# Altium schematic sheet Ethernet.SchDoc
size A3; SheetNumber: 1; SheetTotal: 1; PageSetup: Record=PageOptions|CenterHorizontal=True|CenterVertical=True|PrintScale=0.97|XCorrection=1.00|YCorrection=1.00|PrintKind=1|BorderSize=5000000|LeftOffset=0|BottomOffset=0|Orientation=2|PaperLength=2970|PaperWidth=2100|Scale=100|PaperSource=7|PrintQuality=600|MediaType=1|DitherType=10|PaperKind=A4|PrintScaleMode=1
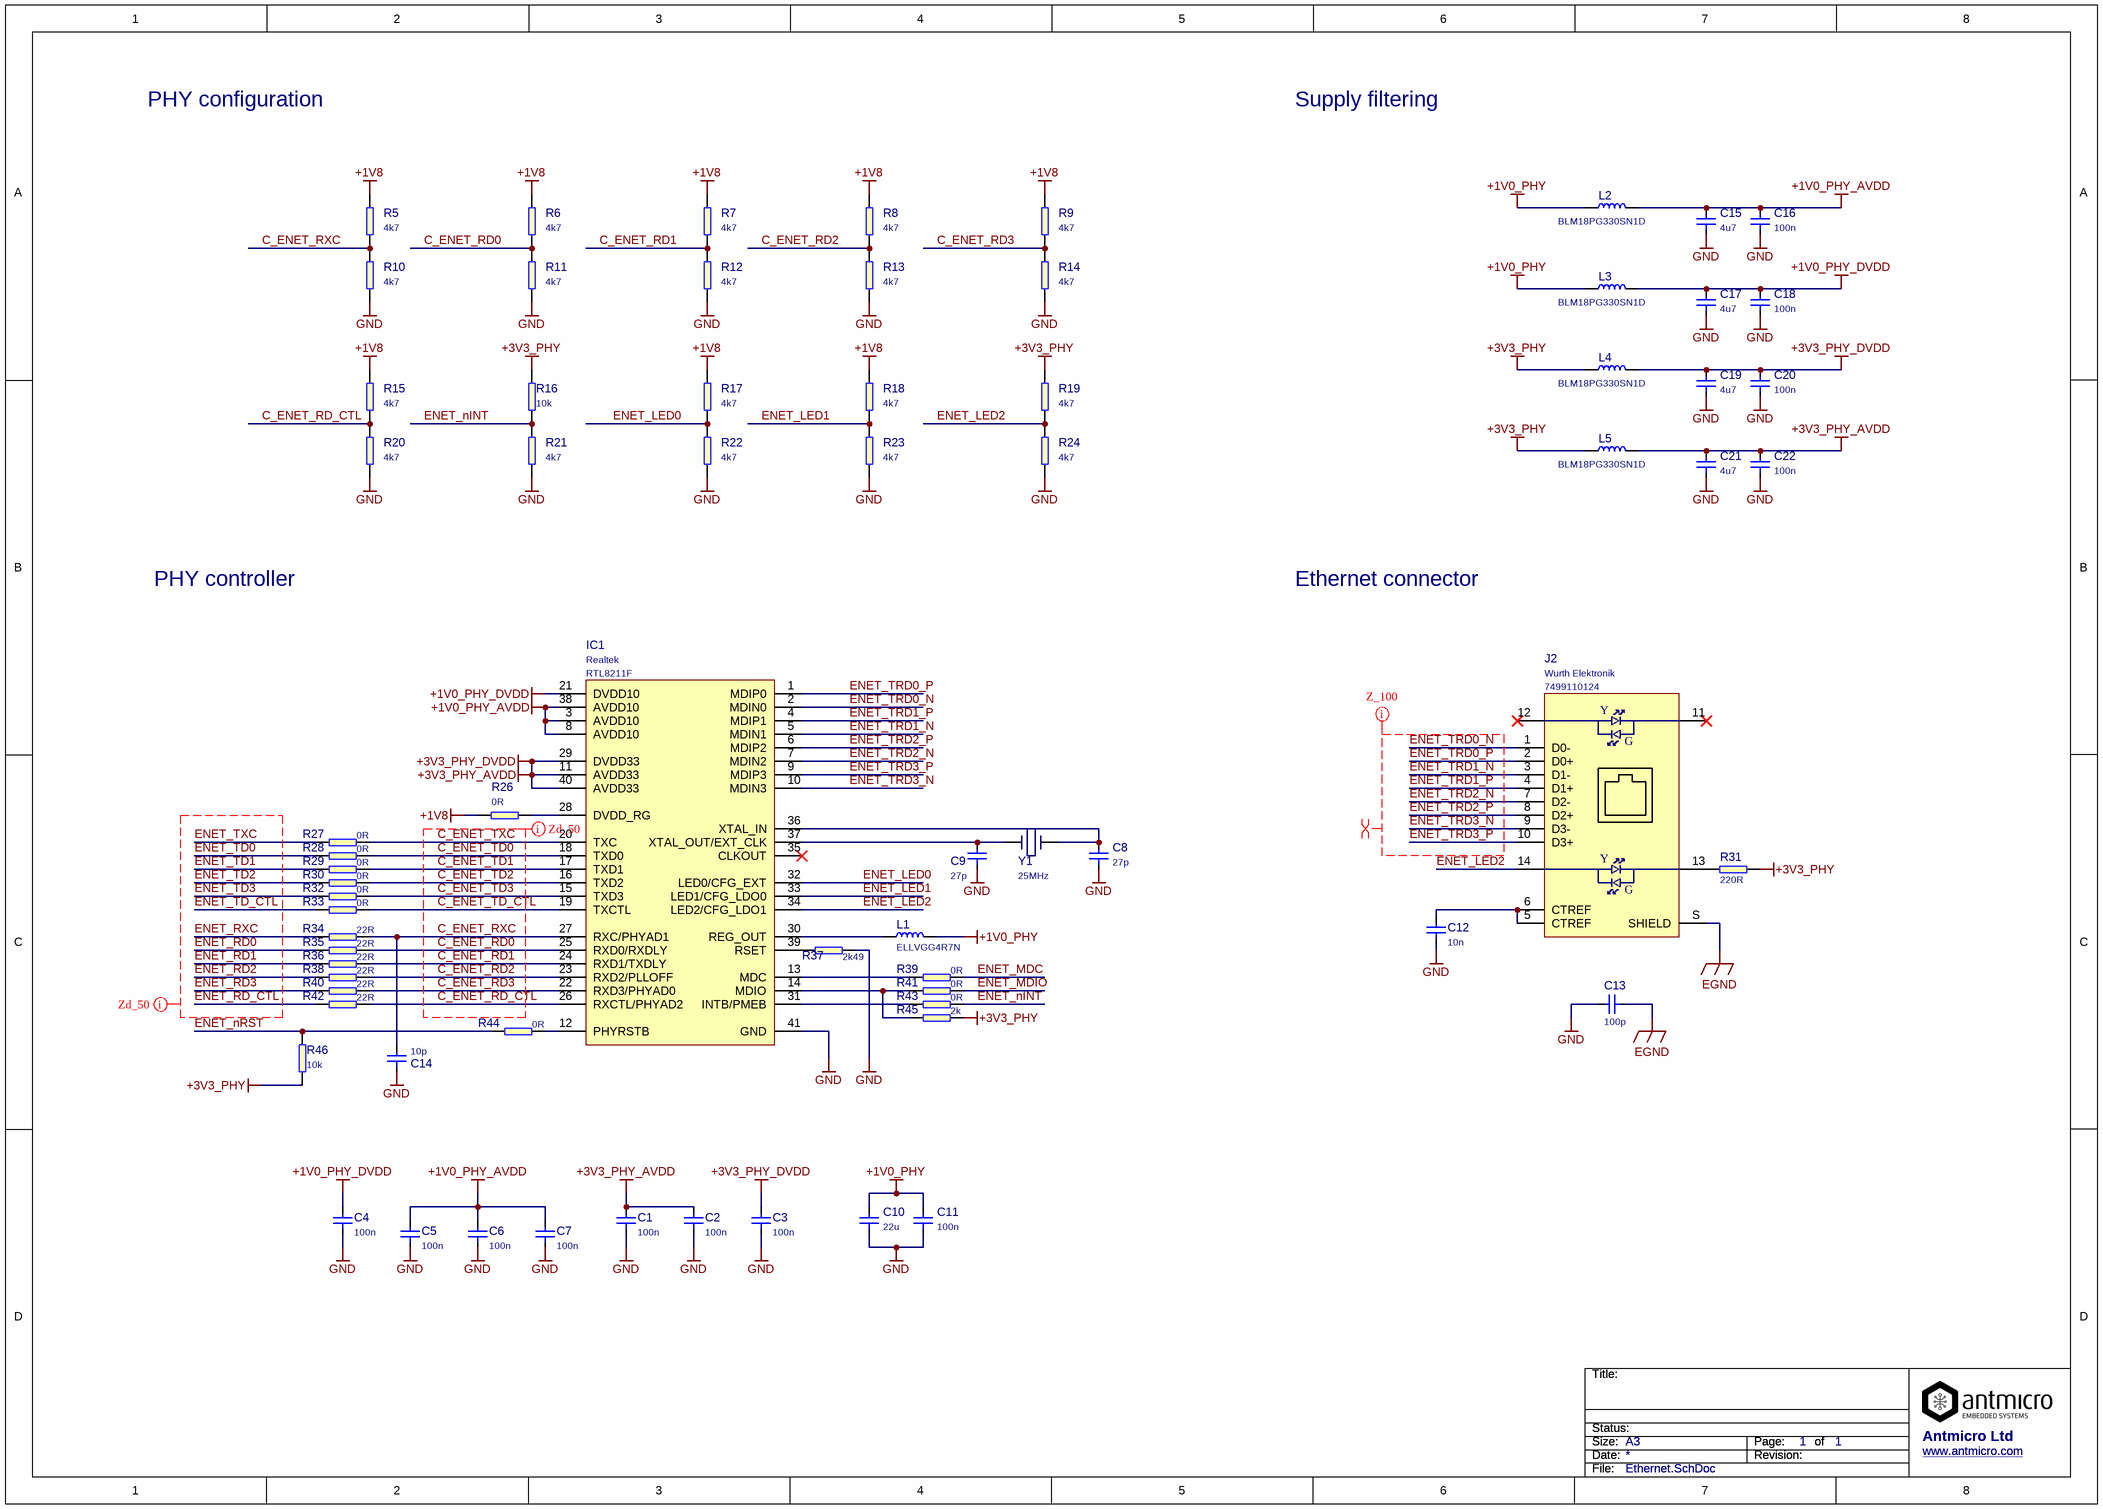
[diagram p0: Ethernet.SchDoc]

## Parts
C1  100n  [C_0402]
C2  100n  [C_0402]
C3  100n  [C_0402]
C4  100n  [C_0402]
C5  100n  [C_0402]
C6  100n  [C_0402]
C7  100n  [C_0402]
C8  27p  [C_0402]
C9  27p  [C_0402]
C10  22u  [1210]
C11  100n  [C_0402]
C12  10n  [0603]
C13  100p  [0603]
C14  10p  [C_0402]
C15  4u7  [0603]
C16  100n  [C_0402]
C17  4u7  [0603]
C18  100n  [C_0402]
C19  4u7  [0603]
C20  100n  [C_0402]
C21  4u7  [0603]
C22  100n  [C_0402]
IC1  RTL8211F  Manufacturer: Realtek  [RTL8211F]
J2  Manufacturer: Wurth Elektronik  [WE_7499110124]  (hidden comment: 7499110124)
L1  ELLVGG4R7N  [ELLVGG4R7N]
L2  BLM18PG330SN1D  [0603]
L3  BLM18PG330SN1D  [0603]
L4  BLM18PG330SN1D  [0603]
L5  BLM18PG330SN1D  [0603]
R5  4k7  [0402]
R6  4k7  [0402]
R7  4k7  [0402]
R8  4k7  [0402]
R9  4k7  [0402]
R10  4k7  [0402]
R11  4k7  [0402]
R12  4k7  [0402]
R13  4k7  [0402]
R14  4k7  [0402]
R15  4k7  [0402]
R16  10k  [0402]
R17  4k7  [0402]
R18  4k7  [0402]
R19  4k7  [0402]
R20  4k7  [0402]
R21  4k7  [0402]
R22  4k7  [0402]
R23  4k7  [0402]
R24  4k7  [0402]
R26  0R  [0402]
R27  0R  [0402]
R28  0R  [0402]
R29  0R  [0402]
R30  0R  [0402]
R31  220R  [0402]
R32  0R  [0402]
R33  0R  [0402]
R34  22R  [0402]
R35  22R  [0402]
R36  22R  [0402]
R37  2k49  [0603]
R38  22R  [0402]
R39  0R  [0402]
R40  22R  [0402]
R41  0R  [0402]
R42  22R  [0402]
R43  0R  [0402]
R44  0R  [0402]
R45  2k  [0402]
R46  10k  [0402]
Y1  25MHz  [TXC_7A]

## Nets
+1V0_PHY: C10.2 C11.2 L1.2 L2.1 L3.1
+1V0_PHY_AVDD: C5.2 C6.2 C7.2 C15.2 C16.2 IC1.3(AVDD10) IC1.8(AVDD10) IC1.38(AVDD10) L2.2
+1V0_PHY_DVDD: C4.2 C17.2 C18.2 IC1.21(DVDD10) L3.2
+1V8: R5.2 R6.2 R7.2 R8.2 R9.2 R15.2 R17.2 R18.2 R26.1
+3V3_PHY: L4.1 L5.1 R16.2 R19.2 R31.2 R45.2 R46.1
+3V3_PHY_AVDD: C1.2 C2.2 C3.2 C19.2 C20.2 C21.2 C22.2 IC1.11(AVDD33) IC1.29(DVDD33) IC1.40(AVDD33) L4.2 L5.2  [also labelled +3V3_PHY_DVDD]
EGND: C13.1 J2.S(SHIELD)
GND: C1.1 C2.1 C3.1 C4.1 C5.1 C6.1 C7.1 C8.1 C9.1 C10.1 C11.1 C12.1 C13.2 C14.1 C15.1 C16.1 C17.1 C18.1 C19.1 C20.1 C21.1 C22.1 IC1.41(GND) R10.1 R11.1 R12.1 R13.1 R14.1 R20.1 R21.1 R22.1 R23.1 R24.1 R37.2
C_ENET_RD0: IC1.25(RXD0/RXDLY) R6.1 R11.2 R35.2
C_ENET_RD1: IC1.24(RXD1/TXDLY) R7.1 R12.2 R36.2
C_ENET_RD2: IC1.23(RXD2/PLLOFF) R8.1 R13.2 R38.2
C_ENET_RD3: IC1.22(RXD3/PHYAD0) R9.1 R14.2 R40.2
C_ENET_RD_CTL: IC1.26(RXCTL/PHYAD2) R15.1 R20.2 R42.2
C_ENET_RXC: C14.2 IC1.27(RXC/PHYAD1) R5.1 R10.2 R34.2
C_ENET_TD0: IC1.18(TXD0) R28.2
C_ENET_TD1: IC1.17(TXD1) R29.2
C_ENET_TD2: IC1.16(TXD2) R30.2
C_ENET_TD3: IC1.15(TXD3) R32.2
C_ENET_TD_CTL: IC1.19(TXCTL) R33.2
C_ENET_TXC: IC1.20(TXC) R27.2
ENET_LED0: IC1.32(LED0/CFG_EXT) R17.1 R22.2
ENET_LED1: IC1.33(LED1/CFG_LDO0) R18.1 R23.2
ENET_LED2: IC1.34(LED2/CFG_LDO1) J2.14 R19.1 R24.2
ENET_MDC: R39.2
ENET_MDIO: R41.2
ENET_nINT: R16.1 R21.2 R43.2
ENET_nRST: R44.1 R46.2
ENET_RD0: R35.1
ENET_RD1: R36.1
ENET_RD2: R38.1
ENET_RD3: R40.1
ENET_RD_CTL: R42.1
ENET_RXC: R34.1
ENET_TD0: R28.1
ENET_TD1: R29.1
ENET_TD2: R30.1
ENET_TD3: R32.1
ENET_TD_CTL: R33.1
ENET_TRD0_N: IC1.2(MDIN0) J2.1(D0-)
ENET_TRD0_P: IC1.1(MDIP0) J2.2(D0+)
ENET_TRD1_N: IC1.5(MDIN1) J2.3(D1-)
ENET_TRD1_P: IC1.4(MDIP1) J2.4(D1+)
ENET_TRD2_N: IC1.7(MDIN2) J2.7(D2-)
ENET_TRD2_P: IC1.6(MDIP2) J2.8(D2+)
ENET_TRD3_N: IC1.10(MDIN3) J2.9(D3-)
ENET_TRD3_P: IC1.9(MDIP3) J2.10(D3+)
ENET_TXC: R27.1
NetC8_2: C8.2 IC1.36(XTAL_IN) Y1.2
NetC9_2: C9.2 IC1.37(XTAL_OUT/EXT_CLK) Y1.1
NetC12_2: C12.2 J2.5(CTREF) J2.6(CTREF)
NetIC1_12: IC1.12(PHYRSTB) R44.2
NetIC1_13: IC1.13(MDC) R39.1
NetIC1_14: IC1.14(MDIO) R41.1 R45.1
NetIC1_28: IC1.28(DVDD_RG) R26.2
NetIC1_30: IC1.30(REG_OUT) L1.1
NetIC1_31: IC1.31(INTB/PMEB) R43.1
NetIC1_39: IC1.39(RSET) R37.1
NetJ2_13: J2.13 R31.1

Not connected (* = marked no-connect by the designer): IC1 35(CLKOUT)*; J2 11* 12*

## Layout directives
net class Z_100: ENET_TRD0_N, ENET_TRD0_P, ENET_TRD1_N, ENET_TRD1_P, ENET_TRD2_N, ENET_TRD2_P, ENET_TRD3_N, ENET_TRD3_P
differential pair: ENET_TRD0_N, ENET_TRD0_P, ENET_TRD1_N, ENET_TRD1_P, ENET_TRD2_N, ENET_TRD2_P, ENET_TRD3_N, ENET_TRD3_P
net class Z_50: C_ENET_RD0, C_ENET_RD1, C_ENET_RD2, C_ENET_RD3, C_ENET_RD_CTL, C_ENET_RXC, C_ENET_TD0, C_ENET_TD1, C_ENET_TD2, C_ENET_TD3, C_ENET_TD_CTL, C_ENET_TXC, ENET_RD0, ENET_RD1, ENET_RD2, ENET_RD3, ENET_RD_CTL, ENET_RXC, ENET_TD0, ENET_TD1, ENET_TD2, ENET_TD3, ENET_TD_CTL, ENET_TXC

## Notes on the sheet
- PHY configuration
- Supply filtering
- PHY controller
- Ethernet connector
- Title:
- Size:
- Date:
- Status:
- A3
- Revision:
- Page:
- of
- Antmicro Ltd
- www.antmicro.com
- File:
- (in symbol WE_7499110124) Y; G

## Library data of the parts
C1-C7 C11 C16 C18 C20 C22 = C_100n_0402: MLCC SMT Capacitor 100nF 0402; PartNumber: C_100n_0402; Value: 100n
C8 C9 = C_27p_0402: MLCC SMT Capacitor 27pF 0402; PartNumber: C_27p_0402; Value: 27p
C10 = C_22u_1210: MLCC SMT Capacitor 22uF 1210; PartNumber: C_22u_1210; Value: 22u
C12 = C_10n_0603: MLCC SMT Capacitor 10nF 0603; PartNumber: C_10n_0603; Value: 10n
C13 = C_100p_0603: MLCC SMT Capacitor 100pF 0603; PartNumber: C_100p_0603; Value: 100p
C14 = C_10p_0402: MLCC SMT Capacitor 10pF 0402; PartNumber: C_10p_0402; Value: 10p
C15 C17 C19 C21 = C_4u7_0603: MLCC SMT Capacitor 4u7F 0603; PartNumber: C_4u7_0603; Value: 4u7
IC1 = RTL8211F: Highly Integrated 10/100/1000m Ethernet Transceiver; PartNumber: RTL8211F; Value: RTL8211F
J2 = WE_7499110124: LAN-Transformer WE-RJ45LAN 10/100/1000 BaseT; PartNumber: 7499110124; Value: 7499110124
L1 = ELLVGG4R7N: PANASONIC ELECTRONIC COMPONENTS  ELLVGG4R7N  Surface Mount Power Inductor, Choke Coil, ELL-VGG Series, 4.7 ?H, ? 30%, Shielded, 0.17 ohm, 980 mA; Manufacturer: PANASONIC ELECTRONIC COMPONENTS / ELLVGG4R7N / PANASONIC ELECTRONIC COMPONENTS; PartNumber: ELLVGG4R7N; Value: ELLVGG4R7N
L2-L5 = BLM18PG330SN1D: MURATA 	BLM18PG330SN1D  FERRITE BEAD, 0.025OHM, 3A, 0603; Value: BLM18PG330SN1D; Manufacturer: MURATA; PartNumber: BLM18PG330SN1D
R5-R15 R17-R24 = R_4k7_0402: SMT Resistor 4k7 0402; PartNumber: R_4k7_0402; Value: 4k7
R16 R46 = R_10k_0402: SMT Resistor 0402; PartNumber: R_10k_0402; Value: 10k
R26-R30 R32 R33 R39 R41 R43 R44 = R_0R_0402: SMT Resistor 0402; PartNumber: R_0R_0402; Value: 0R
R31 = R_220R_0402: SMT Resistor 220R 0402; PartNumber: R_220R_0402; Value: 220R
R34-R36 R38 R40 R42 = R_22R_0402: SMT Resistor 22R 0402; PartNumber: R_22R_0402; Value: 22R
R37 = R_2k49_0603_1%: SMT Resistor 2k49 0603 1%; PartNumber: R_2k49_0603_1%; Value: 2k49
R45 = R_2k_0402: SMT Resistor 2k 0402; PartNumber: R_2k_0402; Value: 2k
Y1 = CRYSTAL_25MHz_SMD_TXC: CRYSTAL, 25.000MHZ; Manufacturer: TXC; Value: 25MHz; PartNumber: CRYSTAL_25MHz_SMD_TXC